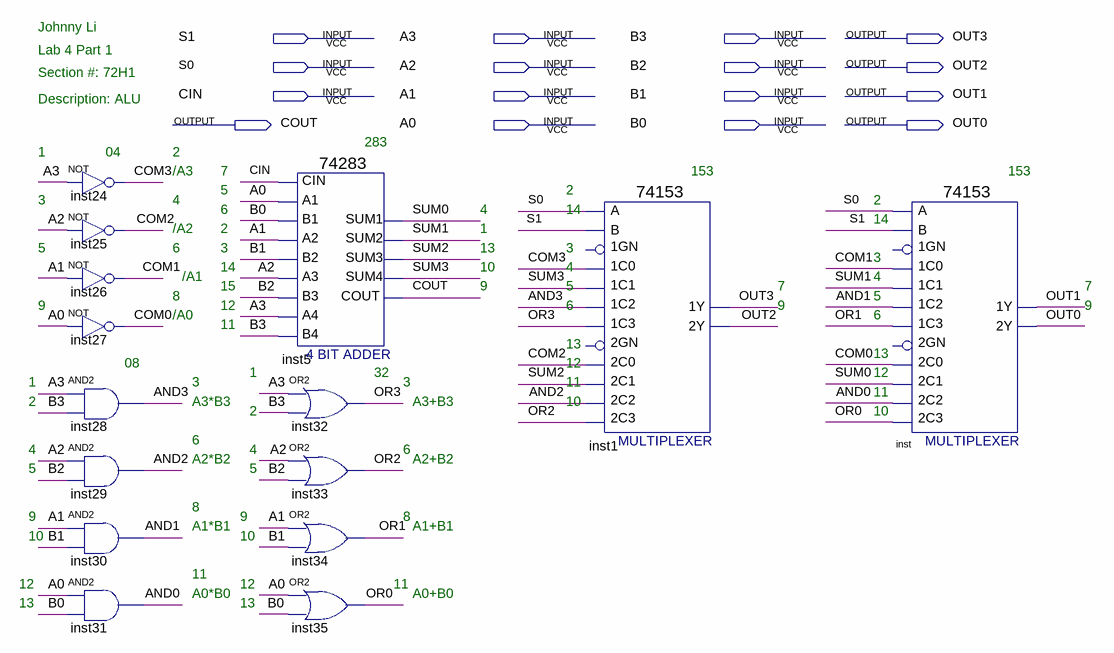
[diagram p0: schematic sheet]
// Quartus schematic Lab4_ALU.bdf as structural Verilog: 15 symbols, 16 pins
module Lab4_ALU (
  input  S1,
  input  A3,
  input  B3,
  input  S0,
  input  A2,
  input  B2,
  input  CIN,
  input  A1,
  input  B1,
  input  A0,
  input  B0,
  output OUT3,
  output OUT2,
  output OUT1,
  output COUT,
  output OUT0
);

  wire AND0, AND1, AND2, AND3, COM0, COM1, COM2, COM3, OR0, OR1, OR2, OR3, SUM0, SUM1, SUM2, SUM3;

  not inst24 (COM3, A3);
  not inst25 (COM2, A2);
  not inst26 (COM1, A1);
  not inst27 (COM0, A0);
  and inst28 (AND3, A3, B3);
  and inst29 (AND2, A2, B2);
  and inst30 (AND1, A1, B1);
  and inst31 (AND0, A0, B0);
  \74283  inst5 (
    .CIN(CIN), .A1(A0), .A2(A1), .B2(B1), .A3(A2), .A4(A3), .B4(B3), .B1(B0), .B3(B2), .SUM4(SUM3),
    .COUT(COUT), .SUM1(SUM0), .SUM2(SUM1), .SUM3(SUM2));
  or inst32 (OR3, A3, B3);
  or inst33 (OR2, A2, B2);
  or inst34 (OR1, A1, B1);
  or inst35 (OR0, A0, B0);
  \74153  inst1 (
    .\1C1 (SUM3), .\1C0 (COM3), .\2C0 (COM2), .\2C2 (AND2), .\1C2 (AND3), .\1C3 (OR3), .B(S1), .A(S0),
    .\2C1 (SUM2), .\2C3 (OR2), .\1Y (OUT3), .\2Y (OUT2));  // open: 1GN, 2GN
  \74153  inst (
    .\1C1 (SUM1), .\1C0 (COM1), .\2C0 (COM0), .\2C2 (AND0), .\1C2 (AND1), .\1C3 (OR1), .B(S1), .A(S0),
    .\2C1 (SUM0), .\2C3 (OR0), .\1Y (OUT1), .\2Y (OUT0));  // open: 1GN, 2GN

  // Notes on the sheet:
  //   Johnny Li 
  //   Lab 4 Part 1
  //   Section #: 72H1
  //   Description: ALU
  //   283
  //   1
  //   04
  //   2
  //   /A3
  //   7
  //   153
  //   153
  //   5
  //   2
  //   3
  //   4
  //   2
  //   6
  //   4
  //   14
  //   14
  //   /A2
  //   2
  //   1
  //   5
  //   6
  //   3
  //   13
  //   3
  //   3
  //   14
  //   10
  //   4
  //   /A1
  //   4
  //   15
  //   9
  //   5
  //   7
  //   7
  //   8
  //   5
  //   9
  //   12
  //   6
  //   9
  //   9
  //   /A0
  //   6
  //   11
  //   13
  //   13
  //   08
  //   12
  //   1
  //   32
  //   12
  //   1
  //   3
  //   3
  //   11
  //   11
  //   2
  //   A3*B3
  //   A3+B3
  //   10
  //   2
  //   10
  //   6
  //   4
  //   4
  //   6
  //   A2*B2
  //   A2+B2
  //   5
  //   5
  //   8
  //   9
  //   9
  //   8
  //   A1*B1
  //   A1+B1
  //   10
  //   10
  //   11
  //   12
  //   12
  //   11
  //   A0*B0
  //   A0+B0
  //   13
  //   13
endmodule
